# EAGLE schematic TestPrint (EAGLE 9.5.0)
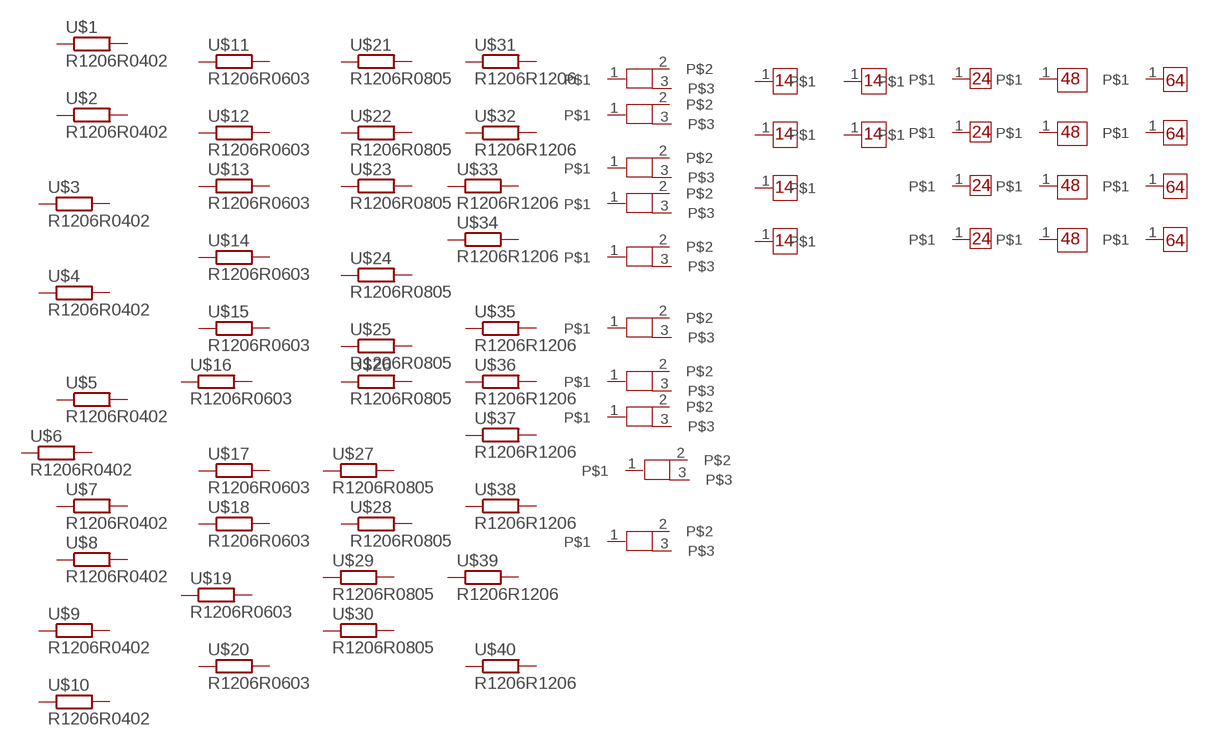
[diagram p0: schematic, sheet 1]

## Parts
U$1  R1206R0402  [R0402]
U$2  R1206R0402  [R0402]
U$3  R1206R0402  [R0402]
U$4  R1206R0402  [R0402]
U$5  R1206R0402  [R0402]
U$6  R1206R0402  [R0402]
U$7  R1206R0402  [R0402]
U$8  R1206R0402  [R0402]
U$9  R1206R0402  [R0402]
U$10  R1206R0402  [R0402]
U$11  R1206R0603  [R0603]
U$12  R1206R0603  [R0603]
U$13  R1206R0603  [R0603]
U$14  R1206R0603  [R0603]
U$15  R1206R0603  [R0603]
U$16  R1206R0603  [R0603]
U$17  R1206R0603  [R0603]
U$18  R1206R0603  [R0603]
U$19  R1206R0603  [R0603]
U$20  R1206R0603  [R0603]
U$21  R1206R0805  [R0805]
U$22  R1206R0805  [R0805]
U$23  R1206R0805  [R0805]
U$24  R1206R0805  [R0805]
U$25  R1206R0805  [R0805]
U$26  R1206R0805  [R0805]
U$27  R1206R0805  [R0805]
U$28  R1206R0805  [R0805]
U$29  R1206R0805  [R0805]
U$30  R1206R0805  [R0805]
U$31  R1206R1206  [R1206]
U$32  R1206R1206  [R1206]
U$33  R1206R1206  [R1206]
U$34  R1206R1206  [R1206]
U$35  R1206R1206  [R1206]
U$36  R1206R1206  [R1206]
U$37  R1206R1206  [R1206]
U$38  R1206R1206  [R1206]
U$39  R1206R1206  [R1206]
U$40  R1206R1206  [R1206]
U$41  SOTSOT-23  [SOT23]
U$42  SOTSOT-23  [SOT23]
U$43  SOTSOT-23  [SOT23]
U$44  SOTSOT-23  [SOT23]
U$45  SOTSOT-23  [SOT23]
U$46  SOTSOT-23  [SOT23]
U$47  SOTSOT-23  [SOT23]
U$48  SOTSOT-23  [SOT23]
U$49  SOTSOT-23  [SOT23]
U$50  SOTSOT-23  [SOT23]
U$51  SO14SO14  [SO14]
U$52  SO14SO14  [SO14]
U$53  SO14SO14  [SO14]
U$54  SO14SO14  [SO14]
U$55  TSSOP14  [TSSOP14]
U$56  TSSOP14  [TSSOP14]
U$57  LQFP-48  [LQFP48]
U$58  TSSOP24  [TSSOP24]
U$59  TSSOP24  [TSSOP24]
U$60  TQFP-64  [TQFP64]
U$61  LQFP-48  [LQFP48]
U$62  TQFP-64  [TQFP64]
U$63  LQFP-48  [LQFP48]
U$64  TQFP-64  [TQFP64]
U$65  LQFP-48  [LQFP48]
U$66  TQFP-64  [TQFP64]
U$67  TSSOP24  [TSSOP24]
U$68  TSSOP24  [TSSOP24]
Unconnected: U$1.1 U$1.2 U$2.1 U$2.2 U$3.1 U$3.2 U$4.1 U$4.2 U$5.1 U$5.2 U$6.1 U$6.2 U$7.1 U$7.2 U$8.1 U$8.2 U$9.1 U$9.2 U$10.1 U$10.2 U$11.1 U$11.2 U$12.1 U$12.2 U$13.1 U$13.2 U$14.1 U$14.2 U$15.1 U$15.2 U$16.1 U$16.2 U$17.1 U$17.2 U$18.1 U$18.2 U$19.1 U$19.2 U$20.1 U$20.2 U$21.1 U$21.2 U$22.1 U$22.2 U$23.1 U$23.2 U$24.1 U$24.2 U$25.1 U$25.2 U$26.1 U$26.2 U$27.1 U$27.2 U$28.1 U$28.2 U$29.1 U$29.2 U$30.1 U$30.2 U$31.1 U$31.2 U$32.1 U$32.2 U$33.1 U$33.2 U$34.1 U$34.2 U$35.1 U$35.2 U$36.1 U$36.2 U$37.1 U$37.2 U$38.1 U$38.2 U$39.1 U$39.2 U$40.1 U$40.2 U$41.1 U$41.2 U$41.3 U$42.1 U$42.2 U$42.3 U$43.1 U$43.2 U$43.3 U$44.1 U$44.2 U$44.3 U$45.1 U$45.2 U$45.3 U$46.1 U$46.2 U$46.3 U$47.1 U$47.2 U$47.3 U$48.1 U$48.2 U$48.3 U$49.1 U$49.2 U$49.3 U$50.1 U$50.2 U$50.3 U$51.1 U$52.1 U$53.1 U$54.1 U$55.1 U$56.1 U$57.1 U$58.1 U$59.1 U$60.1 U$61.1 U$62.1 U$63.1 U$64.1 U$65.1 U$66.1 U$67.1 U$68.1

## Library data of the parts
U$1-U$40 = IC-packages_BIG-pack V1.0:R1206
U$41-U$50 = IC-packages_BIG-pack V1.0:SOT
U$51-U$54 = IC-packages_BIG-pack V1.0:SO14
U$55 U$56 = IC-packages_BIG-pack V1.0:TSSOP14
U$57 U$61 U$63 U$65 = IC-packages_BIG-pack V1.0:LQFP-48
U$58 U$59 U$67 U$68 = IC-packages_BIG-pack V1.0:TSSOP24
U$60 U$62 U$64 U$66 = IC-packages_BIG-pack V1.0:TQFP-64